# EAGLE schematic Signal from sunrise (EAGLE 9.6.2)
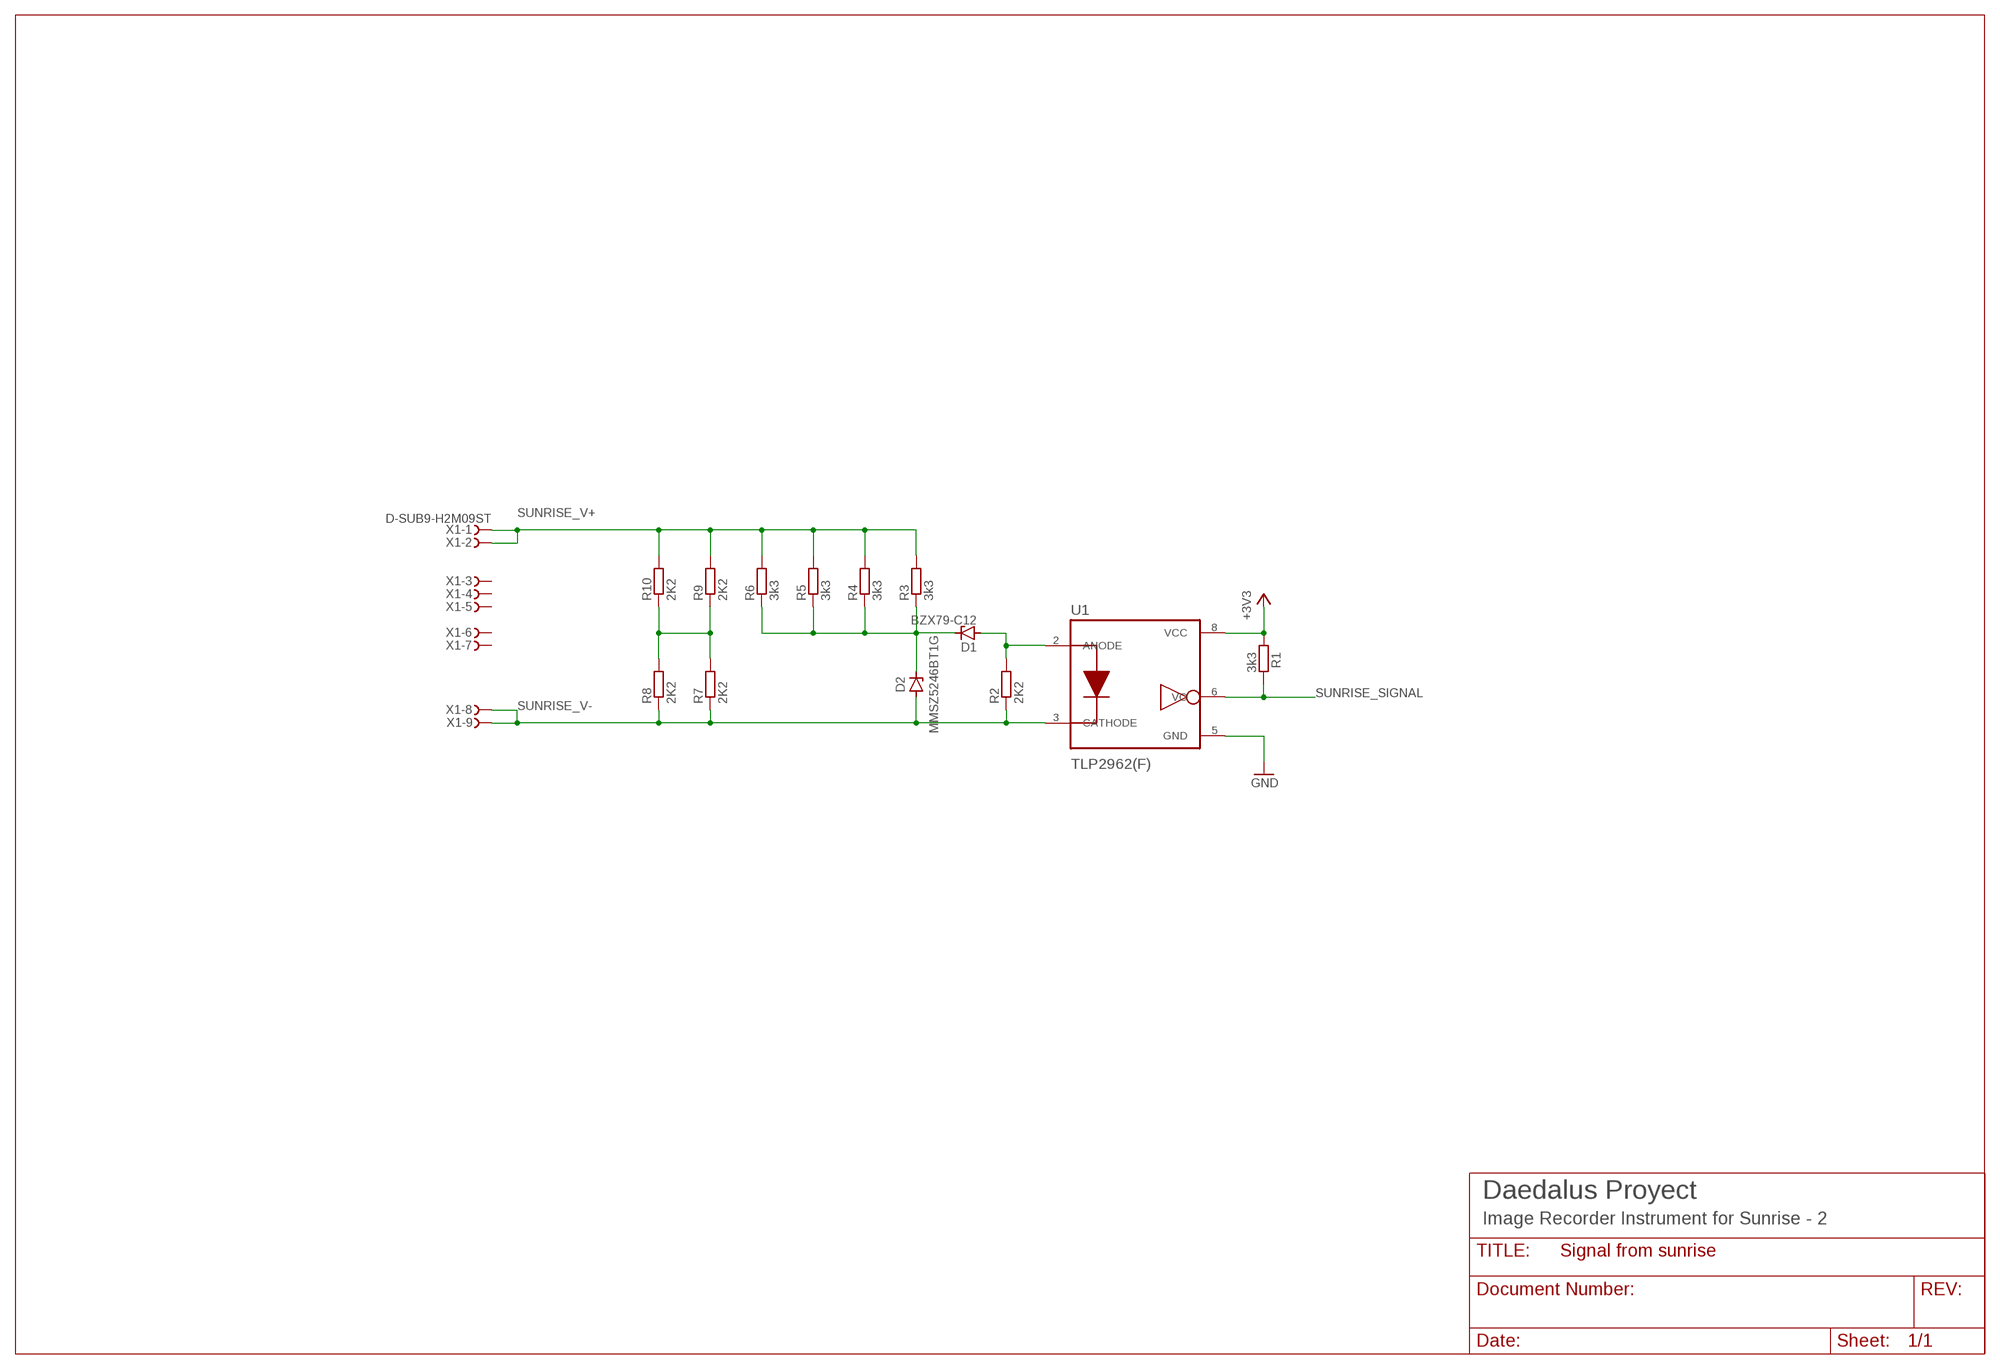
[diagram p0: schematic, sheet 1]

## Parts
D1  BZX79-C12  BZX55  [DO35Z10]
D2  MMSZ5246BT1G  ZENER_MMSZ5240BTDO-219-AB(SOD123F)  [SODFL3718X115]
R1  3k3  R-EU_R1206  [R1206]
R2  2K2  R-EU_R1206  [R1206]
R3  3k3  R-EU_R1206  [R1206]
R4  3k3  R-EU_R1206  [R1206]
R5  3k3  R-EU_R1206  [R1206]
R6  3k3  R-EU_R1206  [R1206]
R7  2K2  R-EU_R1206  [R1206]
R8  2K2  R-EU_R1206  [R1206]
R9  2K2  R-EU_R1206  [R1206]
R10  2K2  R-EU_R1206  [R1206]
U1  TLP2962(F)  [DIP762W50P254L1018H450Q8]
X1  D-SUB9-H2M09ST  [H2M09ST]

## Nets
+3V3: R1.1 U1.8(VCC)
GND: U1.5(GND)
N$2: D1.A R2.2 U1.2(ANODE)
N$4: D1.C D2.1(C) R3.1 R4.1 R5.1 R6.1
N$6: R7.2 R8.2 R9.1 R10.1
SUNRISE_SIGNAL: R1.2 U1.6(VO)
SUNRISE_V+: R3.2 R4.2 R5.2 R6.2 R9.2 R10.2 X1.1 X1.2
SUNRISE_V-: D2.2(A) R2.1 R7.1 R8.1 U1.3(CATHODE) X1.8 X1.9
Unconnected: X1.3 X1.4 X1.5 X1.6 X1.7

## Notes on the sheet
- Daedalus Proyect
- Image Recorder Instrument for Sunrise - 2

## Library data of the parts
D1 = diode:BZX55: Z DIODE
D2 = Diode:ZENER_: Zener Diode - Popular parts; CATEGORY: Diode; DESCRIPTION: DIODE ZENER 10V 500MW SOD123; MANUFACTURER: ON Semiconductor; MPN: MMSZ5240BT1G; SUB-CATEGORY: Zener; THERMALLOSS: 0.5W; VALUE: MMSZ5240BT1G
R1-R10 = resistor:R-EU_: RESISTOR, European symbol
U1 = TLP2962_F_:TLP2962(F): None Check prices <https://pricing.snapeda.com/parts/TLP2962%28F%29/Toshiba%20Semiconductor/view-part?ref=eda>; AVAILABILITY: Warning; DESCRIPTION: Logic Output Optoisolator 15MBd Open Collector 5000Vrms 1 Channel 20kV/µs CMTI 8-DIP; MF: Toshiba Semiconductor; MP: TLP2962(F); PACKAGE: DIP-8 Toshiba; PRICE: None; PURCHASE-URL: https://pricing.snapeda.com/search/part/TLP2962(F)/?ref=eda
X1 = con-thomas-betts:D-SUB9-: D-Subminiatur Connector Source: Electronioc Interconnects European Edition 1998; OC_FARNELL: unknown; OC_NEWARK: unknown